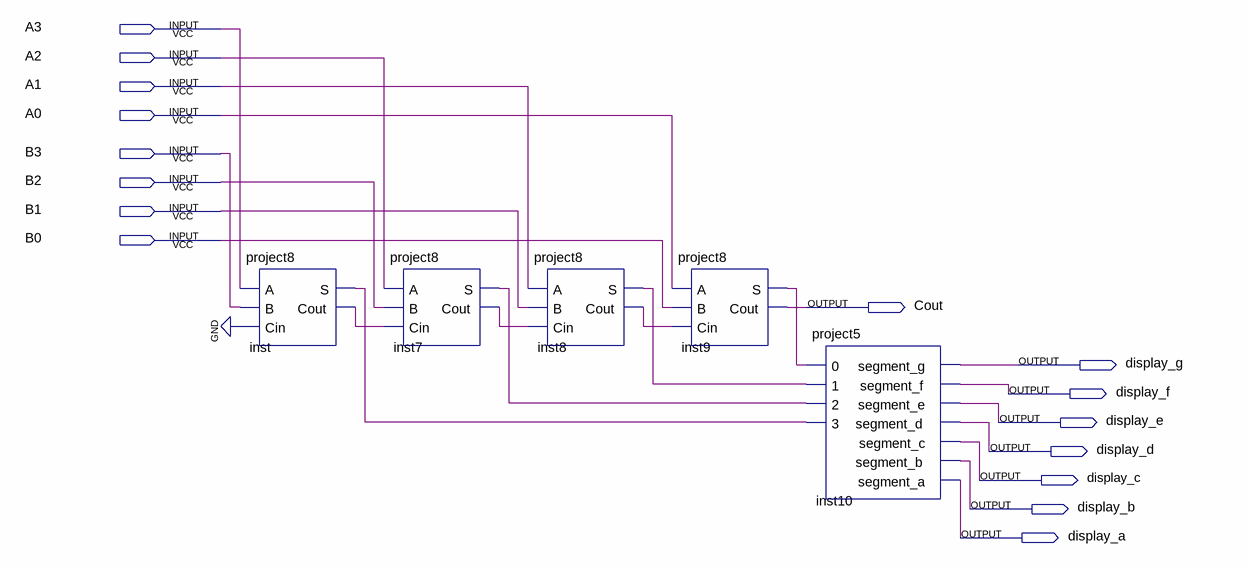
[diagram p0: schematic sheet]
// Quartus schematic project9.bdf as structural Verilog: 5 symbols, 16 pins
module project9 (
  input  A3,
  input  A2,
  input  A1,
  input  A0,
  input  B3,
  input  B2,
  input  B1,
  input  B0,
  output Cout,
  output display_g,
  output display_f,
  output display_e,
  output display_d,
  output display_c,
  output display_b,
  output display_a
);

  wire inst7_cout, inst7_s, inst8_cout, inst8_s, inst9_s, inst_cout, inst_s;

  project8 inst (.A(A3), .B(B3), .Cin(1'b0), .S(inst_s), .Cout(inst_cout));
  project8 inst7 (.A(A2), .B(B2), .Cin(inst_cout), .S(inst7_s), .Cout(inst7_cout));
  project8 inst8 (.A(A1), .B(B1), .Cin(inst7_cout), .S(inst8_s), .Cout(inst8_cout));
  project8 inst9 (.A(A0), .B(B0), .Cin(inst8_cout), .S(inst9_s), .Cout(Cout));
  project5 inst10 (
    .\0 (inst9_s), .\1 (inst8_s), .\2 (inst7_s), .\3 (inst_s), .segment_g(display_g), .segment_f(display_f),
    .segment_e(display_e), .segment_d(display_d), .segment_c(display_c), .segment_b(display_b),
    .segment_a(display_a));
endmodule
